# Altium schematic sheet 4_Modules.SchDoc
size A4; SheetNumber: 4; SheetTotal: 4
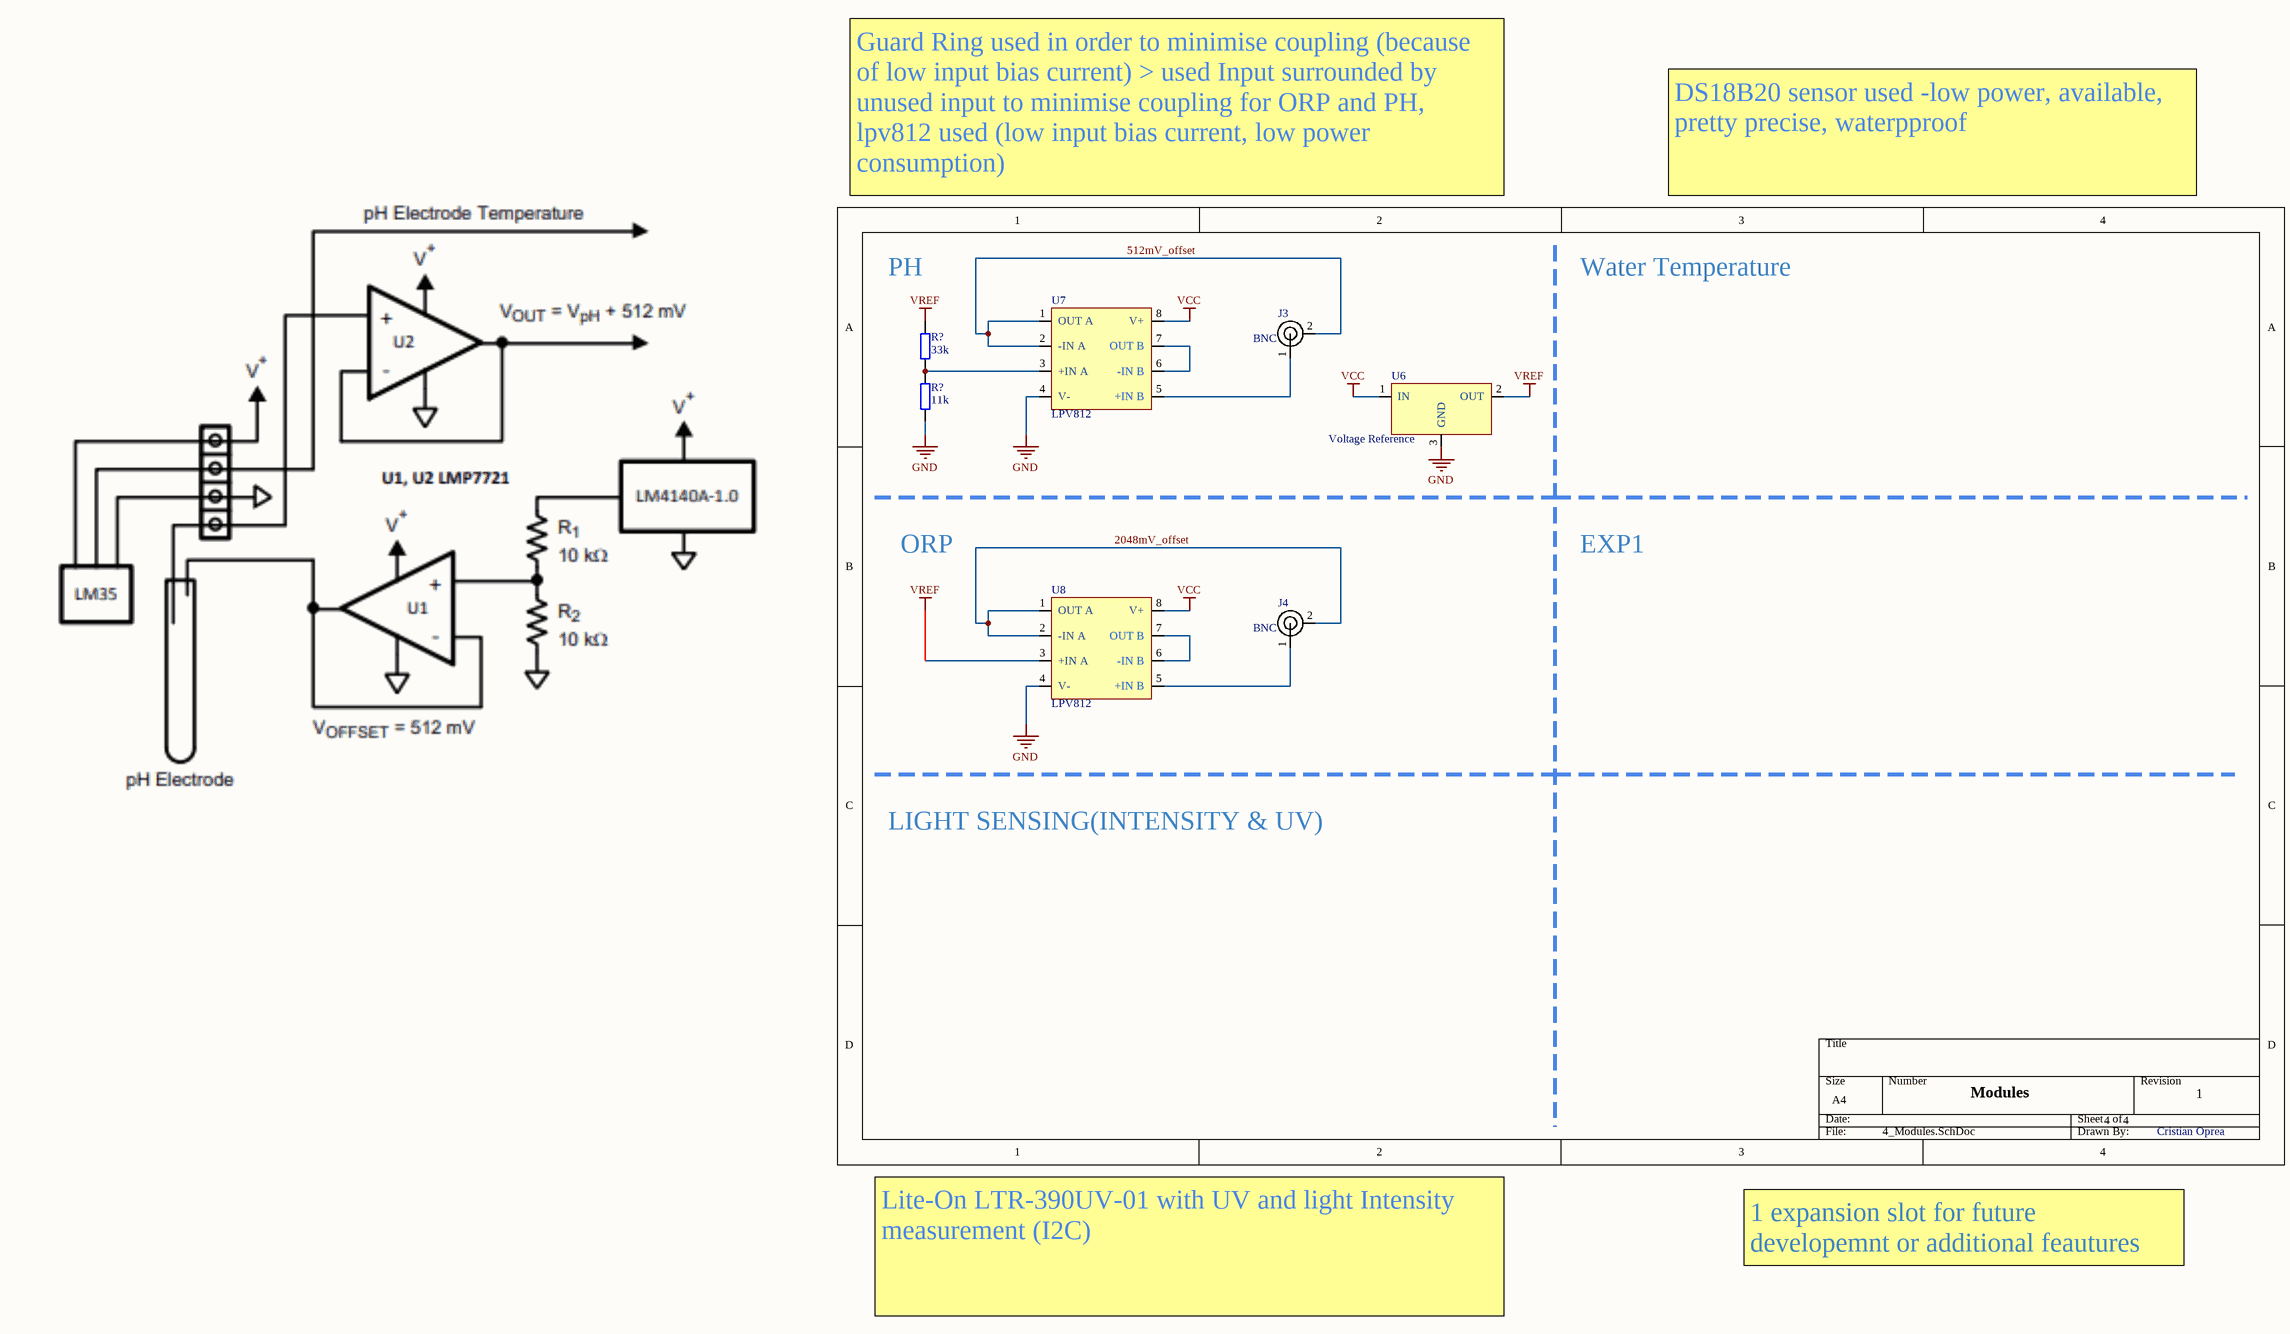
[diagram p0: 4_Modules.SchDoc]

## Parts
(Parts that share a designator on the sheet are numbered #1, #2 ... from top to bottom, then left to right.)
J3  BNC  [U.FL-R-SMT-1(60)]
J4  BNC  [U.FL-R-SMT-1(60)]
R?#1  33k  [RES_0603]
R?#2  11k  [RES_0603]
U6  Voltage Reference  [SOT-23-3]
U7  LPV812
U8  LPV812

## Nets
GND: R?#2.1 U6.3(GND) U7.4(V-) U8.4(V-)
VCC: U6.1(IN) U7.8(V+) U8.8(V+)
VREF: R?#1.2 U6.2(OUT) U8.3(+IN_A)
512mV_offset: J3.2 U7.1(OUT_A) U7.2(-IN_A)
2048mV_offset: J4.2 U8.1(OUT_A) U8.2(-IN_A)
NetJ3_1: J3.1 U7.5(+IN_B)
NetJ4_1: J4.1 U8.5(+IN_B)
NetR?#1_1: R?#1.1 R?#2.2 U7.3(+IN_A)
NetU7_6: U7.6(-IN_B) U7.7(OUT_B)
NetU8_6: U8.6(-IN_B) U8.7(OUT_B)

## Notes on the sheet
- Guard Ring used in order to minimise coupling (because of low input bias current) > used Input surrounded by unused input to minimise coupling for ORP and PH, lpv812 used (low input bias current, low power consumption)
- DS18B20 sensor used -low power, available, pretty precise, waterpproof
- PH
- Water Temperature
- ORP
- EXP1
- LIGHT SENSING(INTENSITY & UV)
- Modules
- 4
- 1
- Cristian Oprea
- Lite-On LTR-390UV-01 with UV and light Intensity measurement (I2C)
- 1 expansion slot for future developemnt or additional feautures

## Library data of the parts
J3 J4 = U.FL-R-SMT-1(60): RF Connector BNC; Manufacturer: Hirose Connector; Manufacturer Part Number: U.FL-R-SMT-1(60)
R?#1 R?#2 = RES_0603: Resistor SMD 0603; Manufacturer: *; Manufacturer Part Number: *; Distributor Link: *; LCSC: *
U6 = VREF: Voltage References 2.048 Low-Cost, Micropower, Low-Dropout, High-Output-Current, SOT23; Manufacturer: Maxim Integrated; Manufacturer Part Number: MAX6101EUR+T
U7 U8 = LPV812: Dual Channel 425nA Precision Nanopower Operational Amplifiers